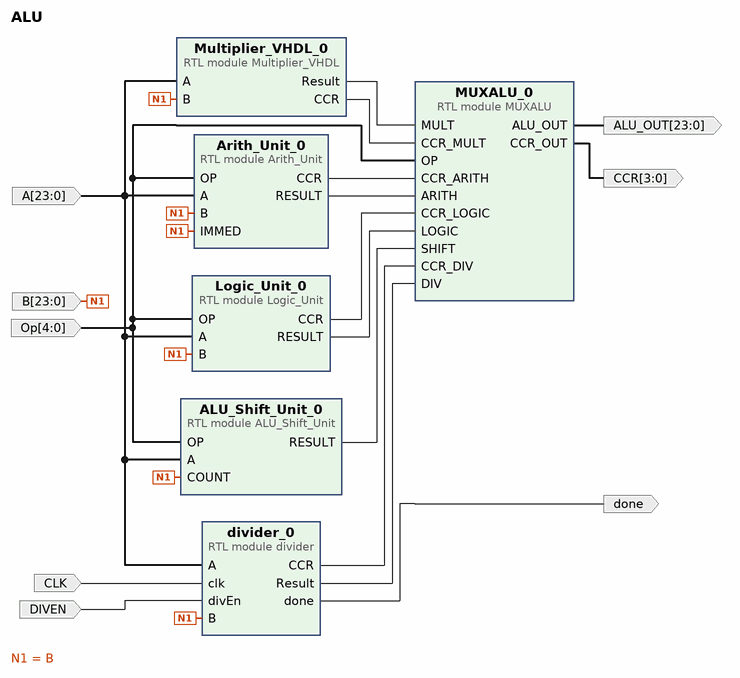
[diagram p0: block diagram of the top level]
# Vivado block design ALU, xc7a100tcsg324-1, Vivado 2017.4
create_bd_design ALU

create_bd_port -dir I -from 4 -to 0 -type data Op
create_bd_port -dir I -from 23 -to 0 -type data A
create_bd_port -dir I -from 23 -to 0 -type data B
create_bd_port -dir O -from 3 -to 0 -type data CCR
create_bd_port -dir O -from 23 -to 0 -type data ALU_OUT
create_bd_port -dir O -type data done
create_bd_port -dir I -type clk CLK
set_property -dict {CONFIG.FREQ_HZ 100000000} [get_bd_ports CLK]
create_bd_port -dir I DIVEN

create_bd_cell -type module -reference ALU_Shift_Unit ALU_Shift_Unit_0
create_bd_cell -type module -reference MUXALU MUXALU_0
create_bd_cell -type module -reference Multiplier_VHDL Multiplier_VHDL_0
create_bd_cell -type module -reference divider divider_0
create_bd_cell -type module -reference Arith_Unit Arith_Unit_0
create_bd_cell -type module -reference Logic_Unit Logic_Unit_0

# ---- connections ----

connect_bd_net [get_bd_pins divider_0/CCR] [get_bd_pins MUXALU_0/CCR_DIV]
connect_bd_net [get_bd_pins Arith_Unit_0/CCR] [get_bd_pins MUXALU_0/CCR_ARITH]
connect_bd_net [get_bd_pins Multiplier_VHDL_0/Result] [get_bd_pins MUXALU_0/MULT]
connect_bd_net [get_bd_pins Arith_Unit_0/RESULT] [get_bd_pins MUXALU_0/ARITH]
connect_bd_net [get_bd_pins divider_0/Result] [get_bd_pins MUXALU_0/DIV]
connect_bd_net [get_bd_pins Multiplier_VHDL_0/CCR] [get_bd_pins MUXALU_0/CCR_MULT]
connect_bd_net [get_bd_pins Logic_Unit_0/CCR] [get_bd_pins MUXALU_0/CCR_LOGIC]
connect_bd_net [get_bd_pins Logic_Unit_0/RESULT] [get_bd_pins MUXALU_0/LOGIC]
connect_bd_net [get_bd_pins ALU_Shift_Unit_0/RESULT] [get_bd_pins MUXALU_0/SHIFT]
connect_bd_net [get_bd_ports Op] \
  [get_bd_pins ALU_Shift_Unit_0/OP] [get_bd_pins MUXALU_0/OP] [get_bd_pins Arith_Unit_0/OP] [get_bd_pins Logic_Unit_0/OP]
connect_bd_net [get_bd_ports A] \
  [get_bd_pins divider_0/A] [get_bd_pins Multiplier_VHDL_0/A] [get_bd_pins ALU_Shift_Unit_0/A] [get_bd_pins Arith_Unit_0/A] \
  [get_bd_pins Logic_Unit_0/A]
connect_bd_net [get_bd_ports B] \
  [get_bd_pins divider_0/B] [get_bd_pins Multiplier_VHDL_0/B] [get_bd_pins ALU_Shift_Unit_0/COUNT] \
  [get_bd_pins Arith_Unit_0/B] [get_bd_pins Arith_Unit_0/IMMED] [get_bd_pins Logic_Unit_0/B]
connect_bd_net [get_bd_pins MUXALU_0/CCR_OUT] [get_bd_ports CCR]
connect_bd_net [get_bd_pins MUXALU_0/ALU_OUT] [get_bd_ports ALU_OUT]
connect_bd_net [get_bd_pins divider_0/done] [get_bd_ports done]
connect_bd_net [get_bd_ports CLK] [get_bd_pins divider_0/clk]
connect_bd_net [get_bd_ports DIVEN] [get_bd_pins divider_0/divEn]

validate_bd_design
save_bd_design
